# Altium project Test Project.PrjPcb
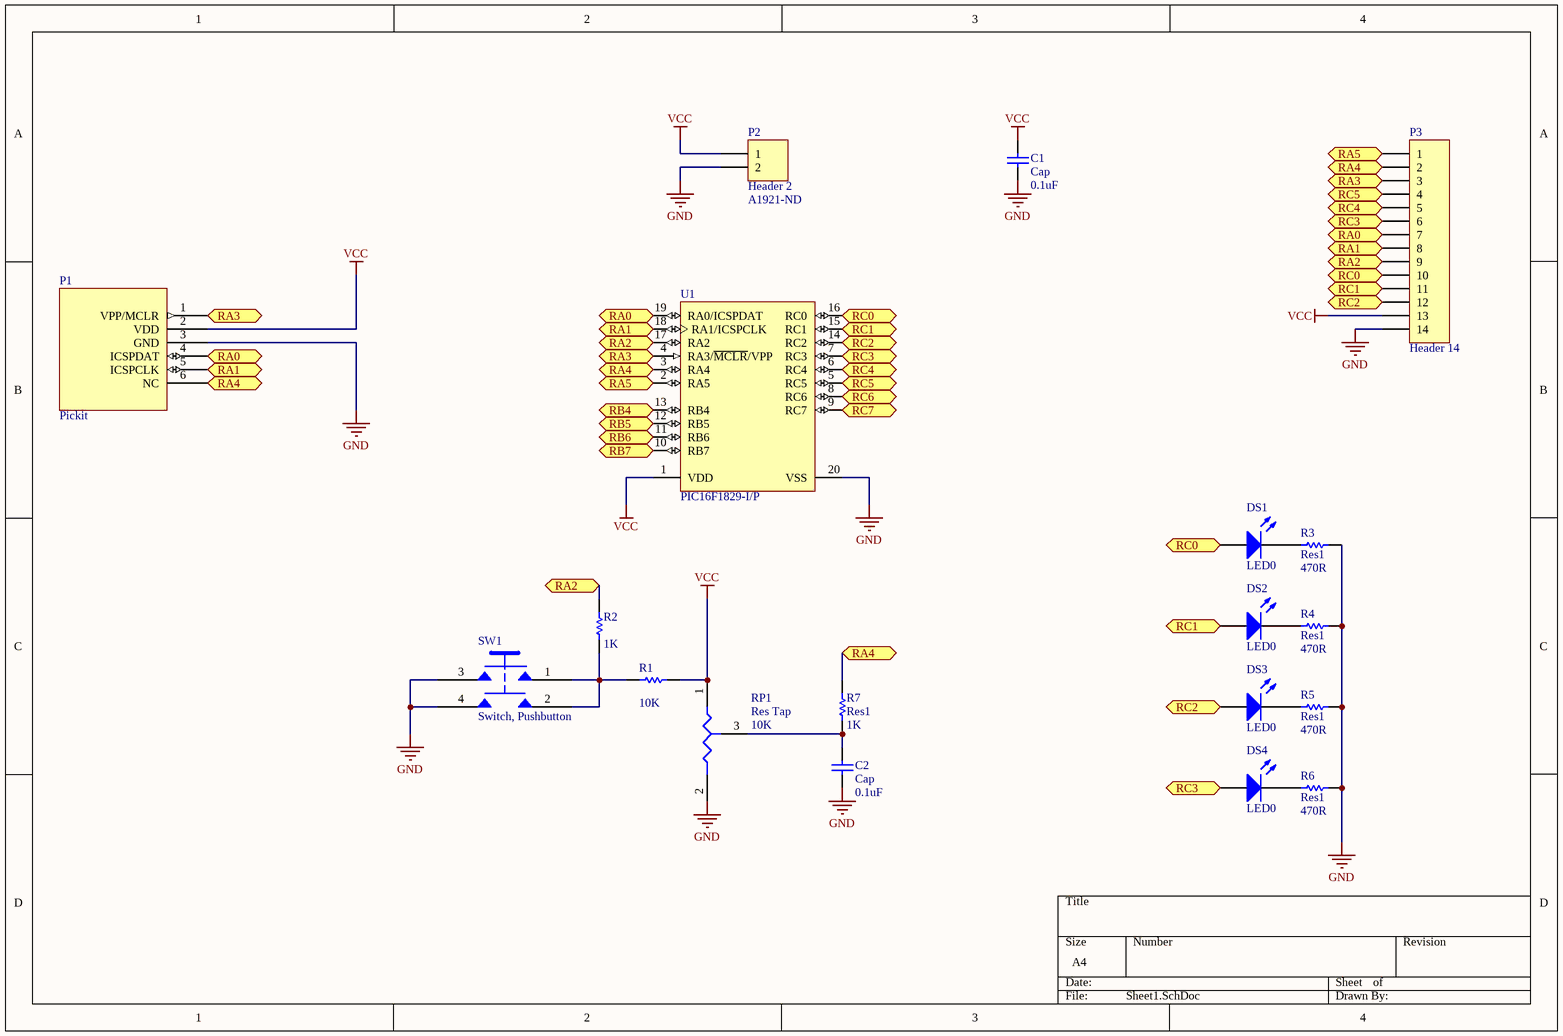
[diagram p0: Sheet1.SchDoc]
2 sheets, 46 parts. Net scope: flat (ports and power ports of the same name join across sheets).
Sheets:
  Sheet1.SchDoc
  Sheet2.SchDoc

## Sheet Sheet1.SchDoc
size A4; Author: D. GREER; DocumentNumber: TEST-1234

### Parts
C1  Cap  value 0.1uF  [CAP-0.1]
C2  Cap  value 0.1uF  [CAP-0.1]
DS1  LED0  [LED-0.1-Upright]
DS2  LED0  [LED-0.1-Upright]
DS3  LED0  [LED-0.1-Upright]
DS4  LED0  [LED-0.1-Upright]
P1  Pickit  [PICKIT HEADER]
P2  Header 2  Supplier Part Number 1: A1921-ND  [HDR1X2]
P3  Header 14  [HDR1X14]
R1  value 10K  [AXIAL-0.3]  (hidden comment: Res1)
R2  value 1K  [AXIAL-0.3]
R3  Res1  value 470R  [AXIAL-0.3]
R4  Res1  value 470R  [AXIAL-0.3]
R5  Res1  value 470R  [AXIAL-0.3]
R6  Res1  value 470R  [AXIAL-0.3]
R7  Res1  value 1K  [AXIAL-0.3]
RP1  Res Tap  value 10K  [TRIM-POT]
SW1  Switch, Pushbutton  [SW-PB2]
U1  PIC16F1829-I/P  [MCHP-PDIP-P20]

### Ports
RA0, RA0 (bidir), RA1, RA1 (bidir), RA2, RA2 (bidir), RA3, RA4, RA4 (bidir), RA5 (bidir), RB4 (bidir), RB5 (bidir), RB6 (bidir), RB7 (bidir), RC0 (bidir), RC1 (bidir), RC2 (bidir), RC3 (bidir), RC4 (bidir), RC5 (bidir), RC6 (bidir), RC7 (bidir)

### Nets
GND: C1.2 C2.2 P1.3(GND) P2.2 P3.14 R3.2 R4.2 R5.2 R6.2 RP1.2(B) SW1.3 SW1.4 U1.20(VSS)
VCC: C1.1 P1.2(VDD) P2.1 P3.13 R1.2 RP1.1(A) U1.1(VDD)
NetC2_1: C2.1 R7.2 RP1.3(TAP)
NetDS1_1: DS1.1(A) P3.10 U1.16(RC0) ; port RC0
NetDS1_2: DS1.2(K) R3.1
NetDS2_1: DS2.1(A) P3.11 U1.15(RC1) ; port RC1
NetDS2_2: DS2.2(K) R4.1
NetDS3_1: DS3.1(A) P3.12 U1.14(RC2) ; port RC2
NetDS3_2: DS3.2(K) R5.1
NetDS4_1: DS4.1(A) P3.6 U1.7(RC3) ; port RC3
NetDS4_2: DS4.2(K) R6.1
NetP1_1: P1.1(VPP/MCLR) P3.3 U1.4(RA3/~{MCLR}/VPP) ; port RA3
NetP1_4: P1.4(ICSPDAT) P3.7 U1.19(RA0/ICSPDAT) ; port RA0
NetP1_5: P1.5(ICSPCLK) P3.8 U1.18(RA1/ICSPCLK) ; port RA1
NetP1_6: P1.6(NC) P3.2 R7.1 U1.3(RA4) ; port RA4
NetP3_1: P3.1 U1.2(RA5) ; port RA5
NetP3_4: P3.4 U1.5(RC5) ; port RC5
NetP3_5: P3.5 U1.6(RC4) ; port RC4
NetP3_9: P3.9 R2.1 U1.17(RA2) ; port RA2
NetR1_1: R1.1 R2.2 SW1.1 SW1.2
NetRB4_1: U1.13(RB4) ; port RB4
NetRB5_1: U1.12(RB5) ; port RB5
NetRB6_1: U1.11(RB6) ; port RB6
NetRB7_1: U1.10(RB7) ; port RB7
NetRC6_1: U1.8(RC6) ; port RC6
NetRC7_1: U1.9(RC7) ; port RC7

### Library data of the parts
C1 C2 = Cap: Capacitor; Published: 8-Jun-2000; LatestRevisionDate: 17-Jul-2002; LatestRevisionNote: Re-released for DXP Platform.; PackageReference: RAD-0.3; Publisher: Altium Limited; PackageDescription: Radial Cap, Thru-Hole; 2 Leads; 0.3 in Pin Spacing; Supplier 1: Mouser; Supplier Part Number 1: 80-C0805C104J5RAUTO
DS1-DS4 = LED0: Typical INFRARED GaAs LED; Published: 8-Jun-2000; LatestRevisionDate: 08-Jul-2005; LatestRevisionNote: Mech Layer 1 removed.; PackageReference: LED-0; Publisher: Altium Limited; PackageDescription: LED; 2 Leads
P2 = Header 2: Header, 2-Pin; LatestRevisionDate: 17-Jul-2002; LatestRevisionNote: Re-released for DXP Platform.; Publisher: Altium Limited; Supplier 1: Digi-Key
P3 = Header 14: Header, 14-Pin; LatestRevisionDate: 17-Jul-2002; LatestRevisionNote: Re-released for DXP Platform.; Publisher: Altium Limited
R1-R7 = Res1: Resistor; Published: 8-Jun-2000; LatestRevisionDate: 17-Jul-2002; LatestRevisionNote: Re-released for DXP Platform.; PackageReference: AXIAL-0.3; Publisher: Altium Limited; PackageDescription: Axial Device, Thru-Hole; 2 Leads; 0.3 in Pin Spacing
RP1 = Res Tap: Tapped Resistor; pin to pad: 2>3 3>2; Sim Note: Enter the Resistance value and the set point into parameter fields.; Set Position: 0.5; Published: 24-Mar-1999; LatestRevisionDate: 17-Jul-2002; LatestRevisionNote: Re-released for DXP Platform.; PackageReference: VR3; Publisher: Altium Limited; PackageDescription: Variable Resistor, Thru-Hole; 3 Leads
U1 = CMP-0115-01811-1: Flash Microcontroller with XLP Technology, 32 MHz, 17 I/O, -40 to 85 degC, 20-pin PDIP (P20), Tube; Manufacturer: Microchip; EEPROM Data Memory (bytes): 256; Operation Voltage Range: 1.8V - 5.5V; I/O Pins: 17; Program Memory KBytes: 14; Program Memory KWords: 8; Internal Oscillator: 32 MHz, 31 kHz; RAM: 1024; # of A/D Channels: 12; Timers: 4 - 8-bit, 1 - 16-bit; Max. CPU Speed MHz: 32; Digital Communication: 1 -A/E/USART, 2 -MSSP(SPI/I2C); Memory Type: Flash; ComponentLink1URL: http://ww1.microchip.com/downloads/en/DeviceDoc/41440C.pdf; PackageReference: PDIP-P20; PackageDescription: 20-Lead Plastic Dual In-Line, Row Spacing 7.62 mm, 25.91 x 6.6 mm Body, 2.54 mm Pitch; PartNumber: PIC16F1829-I/P; ComponentLink1Description: Datasheet; PackageVersion: C04-019B, 12/2012; ComponentLink3Description: URL Link1; Packing: TUBE; ComponentLink2Description: Package Specification; ComponentLink3URL: Product URL:http://www.microchip.com/datasheet/PIC16F1829; DatasheetVersion: Rev. C; ComponentLink2URL: http://www.microchip.com/stellent/groups/techpub_sg/documents/packagingspec/en012702.pdf; RoHS: TRUE; Mounting Technology: Through Hole

## Sheet Sheet2.SchDoc
size A4
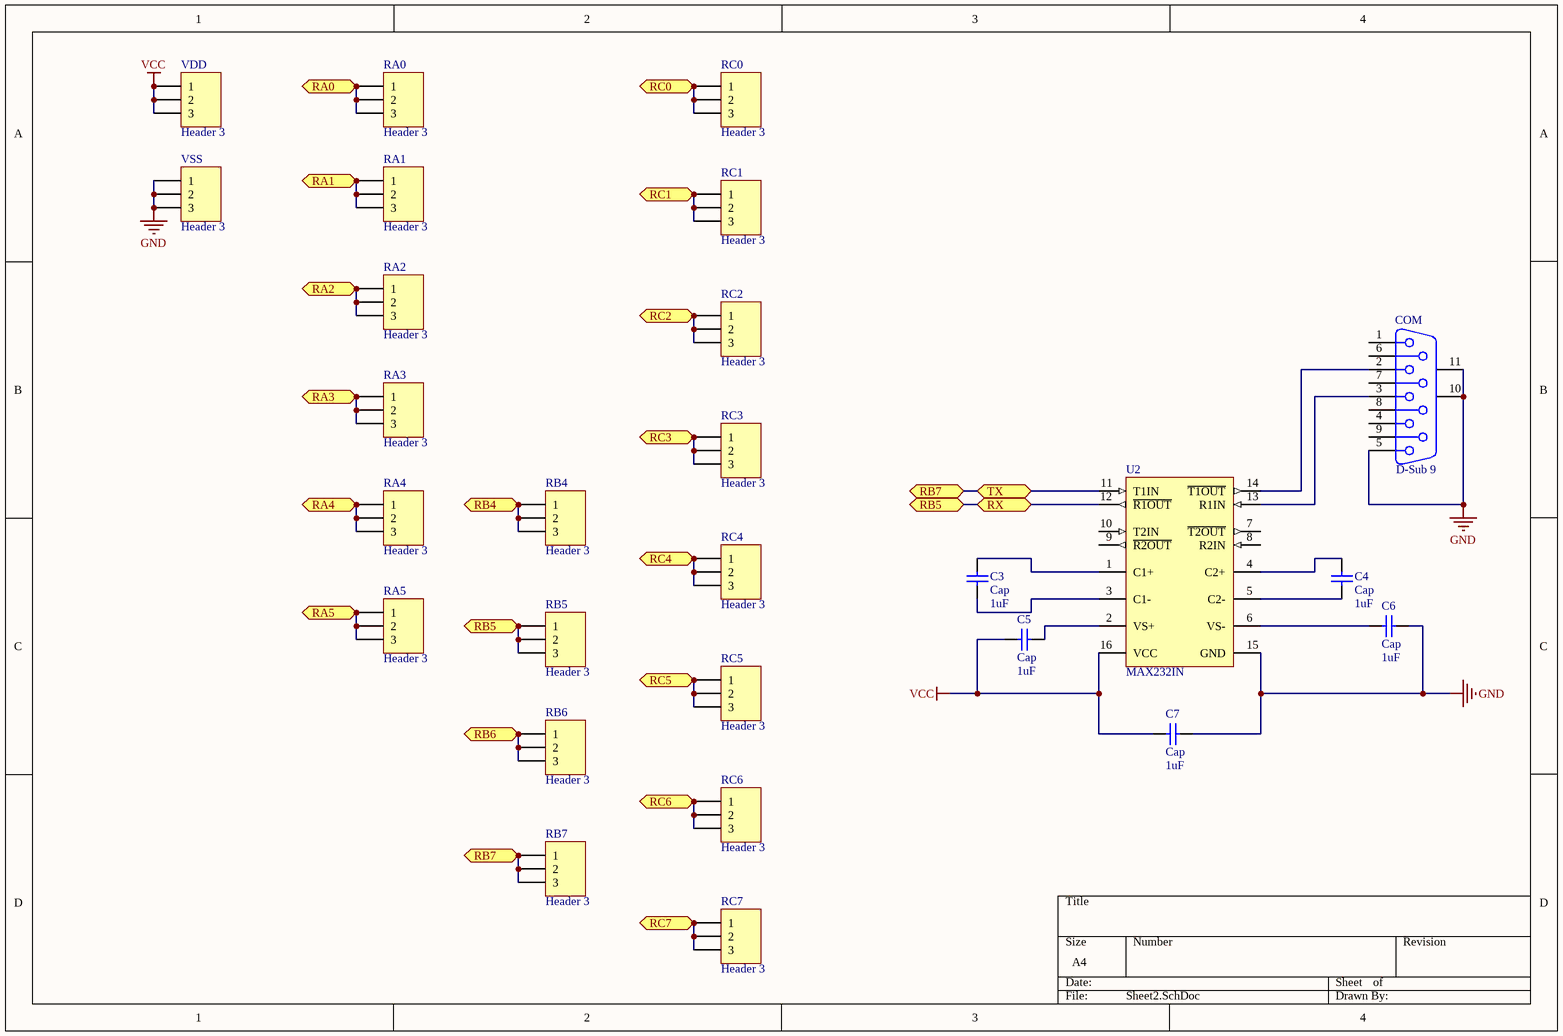
[diagram p1: Sheet2.SchDoc]

### Parts
C3  Cap  value 1uF  [CAP-0.1]
C4  Cap  value 1uF  [CAP-0.1]
C5  Cap  value 1uF  [CAP-0.1]
C6  Cap  value 1uF  [CAP-0.1]
C7  Cap  value 1uF  [CAP-0.1]
COM  D-Sub 9  [DSUB1.385-2H9]
RA0  Header 3  [HDR1X3]
RA1  Header 3  [HDR1X3]
RA2  Header 3  [HDR1X3]
RA3  Header 3  [HDR1X3]
RA4  Header 3  [HDR1X3]
RA5  Header 3  [HDR1X3]
RB4  Header 3  [HDR1X3]
RB5  Header 3  [HDR1X3]
RB6  Header 3  [HDR1X3]
RB7  Header 3  [HDR1X3]
RC0  Header 3  [HDR1X3]
RC1  Header 3  [HDR1X3]
RC2  Header 3  [HDR1X3]
RC3  Header 3  [HDR1X3]
RC4  Header 3  [HDR1X3]
RC5  Header 3  [HDR1X3]
RC6  Header 3  [HDR1X3]
RC7  Header 3  [HDR1X3]
U2  MAX232IN  [N0016A]
VDD  Header 3  [HDR1X3]
VSS  Header 3  [HDR1X3]

### Ports
RA0 (bidir), RA1 (bidir), RA2 (bidir), RA3, RA4 (bidir), RA5 (bidir), RB4 (bidir), RB5 (bidir), RB6 (bidir), RB7 (bidir), RC0 (bidir), RC1 (bidir), RC2 (bidir), RC3 (bidir), RC4 (bidir), RC5 (bidir), RC6 (bidir), RC7 (bidir), RX, TX

### Nets
GND: C6.2 C7.2 COM.5 COM.10(MH1) COM.11(MH2) U2.15(GND) VSS.1 VSS.2 VSS.3
VCC: C5.1 C7.1 U2.16(VCC) VDD.1 VDD.2 VDD.3
NetC3_1: C3.1 U2.1(C1+)
NetC3_2: C3.2 U2.3(C1-)
NetC4_1: C4.1 U2.4(C2+)
NetC4_2: C4.2 U2.5(C2-)
NetC5_2: C5.2 U2.2(VS+)
NetC6_1: C6.1 U2.6(VS-)
NetCOM_2: COM.2 U2.14(~{T1OUT})
NetCOM_3: COM.3 U2.13(R1IN)
NetDS1_1: RC0.1 RC0.2 RC0.3 ; port RC0
NetDS2_1: RC1.1 RC1.2 RC1.3 ; port RC1
NetDS3_1: RC2.1 RC2.2 RC2.3 ; port RC2
NetDS4_1: RC3.1 RC3.2 RC3.3 ; port RC3
NetP1_1: RA3.1 RA3.2 RA3.3 ; port RA3
NetP1_4: RA0.1 RA0.2 RA0.3 ; port RA0
NetP1_5: RA1.1 RA1.2 RA1.3 ; port RA1
NetP1_6: RA4.1 RA4.2 RA4.3 ; port RA4
NetP3_1: RA5.1 RA5.2 RA5.3 ; port RA5
NetP3_4: RC5.1 RC5.2 RC5.3 ; port RC5
NetP3_5: RC4.1 RC4.2 RC4.3 ; port RC4
NetP3_9: RA2.1 RA2.2 RA2.3 ; port RA2
NetRB4_1: RB4.1 RB4.2 RB4.3 ; port RB4
NetRB5_1: RB5.1 RB5.2 RB5.3 U2.12(~{R1OUT}) ; port RB5, port RX
NetRB6_1: RB6.1 RB6.2 RB6.3 ; port RB6
NetRB7_1: RB7.1 RB7.2 RB7.3 U2.11(T1IN) ; port RB7, port TX
NetRC6_1: RC6.1 RC6.2 RC6.3 ; port RC6
NetRC7_1: RC7.1 RC7.2 RC7.3 ; port RC7

Not connected (* = marked no-connect by the designer): COM 1 4 6 7 8 9; U2 7(~{T2OUT}) 8(R2IN) 9(~{R2OUT}) 10(T2IN)

### Library data of the parts
C3-C7 = Cap: Capacitor; Published: 8-Jun-2000; LatestRevisionDate: 17-Jul-2002; LatestRevisionNote: Re-released for DXP Platform.; PackageReference: RAD-0.3; Publisher: Altium Limited; PackageDescription: Radial Cap, Thru-Hole; 2 Leads; 0.3 in Pin Spacing; Supplier 1: Mouser; Supplier Part Number 1: 80-C0805C104J5RAUTO
COM = D Connector 9: Receptacle Assembly, 9 Position, Right Angle; PackageDocument: O; Positions: 9; Published: 15-Jun-2001; LatestRevisionDate: 17-Jul-2002; LatestRevisionNote: Re-released for DXP Platform.; DatasheetDocument: 1-Sep-1999; PackageReference: 788750; Publisher: Altium Limited; Orientation: Right Angle; Gender: Receptacle
RA0-RA5 RB4-RB7 RC0-RC7 VDD VSS = Header 3: Header, 3-Pin; LatestRevisionDate: 17-Jul-2002; LatestRevisionNote: Re-released for DXP Platform.; Publisher: Altium Limited
U2 = CMP-0299-00077-2: Dual EIA-232 Driver / Receiver, -40 to 85 degC, 16-Pin PDIP (N), Pb-Free (RoHS); Drivers Per Package: 2; ICC(Max)(mA): 10; RS-232: TRUE; ESD HBM(kV): +/-2; SubFamily: RS-232; Supply Voltage(s)(V): 5; ComponentLink3Description: Package Specification; PackageDescription: 16-Pin Plastic Dual-In-Line Package, Row Spacing 7.62 mm, Pitch 2.54 mm; PackageVersion: revE, Dec-2002; ComponentLink2URL: http://www.ti.com/general/docs/lit/getliterature.tsp?genericPartNumber=MAX232&fileType=pdf; DatasheetVersion: SLLS047L; ComponentLink2Description: Datasheet; ComponentLink3URL: http://www.ti.com/litv/pdf/mpdi002c; ComponentLink1URL: www.ti.com; ComponentLink1Description: Manufacturer URL; PackageReference: N0016A; Single Supply: TRUE; Receivers Per Package: 2

## Nets that join several sheets
GND: Sheet1 (13 pins), Sheet2 (9 pins)
VCC: Sheet1 (7 pins), Sheet2 (6 pins)
NetDS1_1: Sheet1 (DS1.1 P3.10 U1.16), Sheet2 (RC0.1 RC0.2 RC0.3)
NetDS2_1: Sheet1 (DS2.1 P3.11 U1.15), Sheet2 (RC1.1 RC1.2 RC1.3)
NetDS3_1: Sheet1 (DS3.1 P3.12 U1.14), Sheet2 (RC2.1 RC2.2 RC2.3)
NetDS4_1: Sheet1 (DS4.1 P3.6 U1.7), Sheet2 (RC3.1 RC3.2 RC3.3)
NetP1_1: Sheet1 (P1.1 P3.3 U1.4), Sheet2 (RA3.1 RA3.2 RA3.3)
NetP1_4: Sheet1 (P1.4 P3.7 U1.19), Sheet2 (RA0.1 RA0.2 RA0.3)
NetP1_5: Sheet1 (P1.5 P3.8 U1.18), Sheet2 (RA1.1 RA1.2 RA1.3)
NetP1_6: Sheet1 (P1.6 P3.2 R7.1 U1.3), Sheet2 (RA4.1 RA4.2 RA4.3)
NetP3_1: Sheet1 (P3.1 U1.2), Sheet2 (RA5.1 RA5.2 RA5.3)
NetP3_4: Sheet1 (P3.4 U1.5), Sheet2 (RC5.1 RC5.2 RC5.3)
NetP3_5: Sheet1 (P3.5 U1.6), Sheet2 (RC4.1 RC4.2 RC4.3)
NetP3_9: Sheet1 (P3.9 R2.1 U1.17), Sheet2 (RA2.1 RA2.2 RA2.3)
NetRB4_1: Sheet1 (U1.13), Sheet2 (RB4.1 RB4.2 RB4.3)
NetRB5_1: Sheet1 (U1.12), Sheet2 (RB5.1 RB5.2 RB5.3 U2.12)
NetRB6_1: Sheet1 (U1.11), Sheet2 (RB6.1 RB6.2 RB6.3)
NetRB7_1: Sheet1 (U1.10), Sheet2 (RB7.1 RB7.2 RB7.3 U2.11)
NetRC6_1: Sheet1 (U1.8), Sheet2 (RC6.1 RC6.2 RC6.3)
NetRC7_1: Sheet1 (U1.9), Sheet2 (RC7.1 RC7.2 RC7.3)